# Altium schematic sheet BLDC_Controller_Sch.SchDoc
size A2
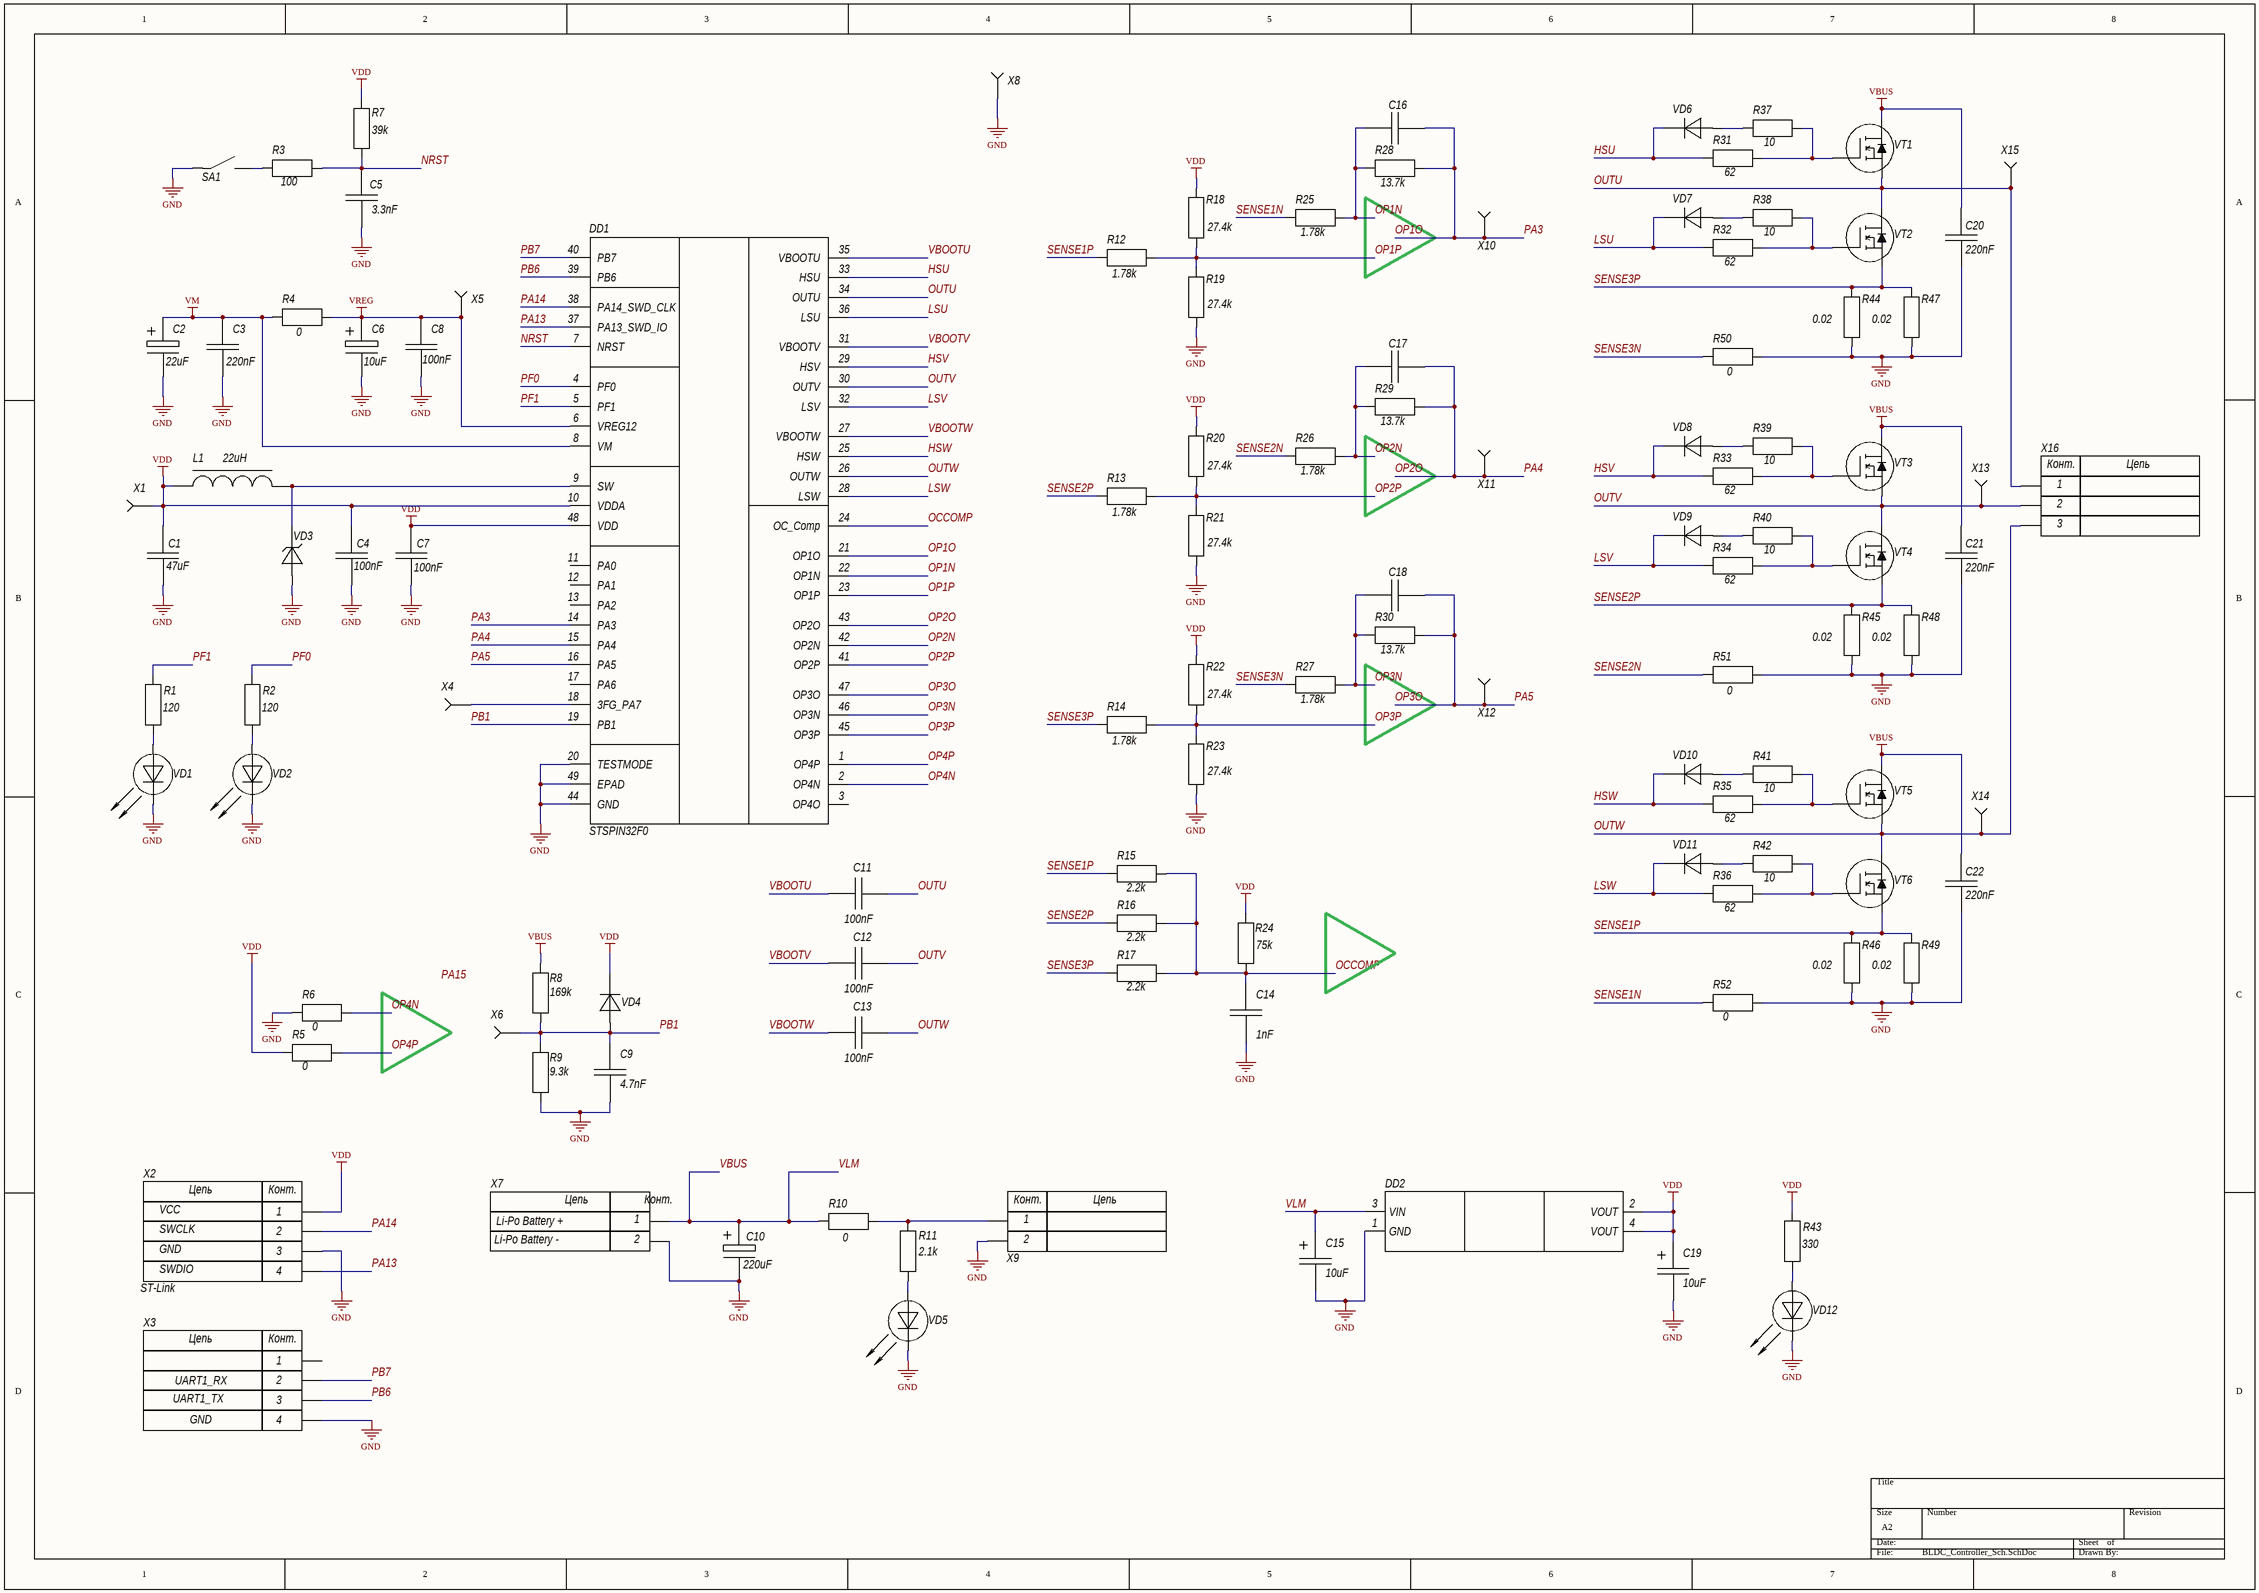
[diagram p0: BLDC_Controller_Sch.SchDoc]

## Parts
C1  value 47uF  [CAP EIA 0603]  (hidden comment: Cap EIA 0603)
C2  value 22uF  [CAP EL CASE F]  (hidden comment: Cap El SMT Case F)
C3  value 220nF  [CAP EIA 0805]  (hidden comment: Cap EIA 0805)
C4  value 100nF  [CAP EIA 0603]  (hidden comment: Cap EIA 0603)
C5  value 3.3nF  [CAP EIA 0805]  (hidden comment: Cap EIA 0805)
C6  value 10uF  [CAP EL CASE F]  (hidden comment: Cap El SMT Case F)
C7  value 100nF  [CAP EIA 0603]  (hidden comment: Cap EIA 0603)
C8  value 100nF  [CAP EIA 0805]  (hidden comment: Cap EIA 0805)
C9  value 4.7nF  [CAP EIA 0603]  (hidden comment: Cap EIA 0603)
C10  value 220uF  [CAP EL CASE F]  (hidden comment: Cap El SMT Case F)
C11  value 100nF  [CAP EIA 0603]  (hidden comment: Cap EIA 0603)
C12  value 100nF  [CAP EIA 0603]  (hidden comment: Cap EIA 0603)
C13  value 100nF  [CAP EIA 0603]  (hidden comment: Cap EIA 0603)
C14  value 1nF  [CAP EIA 0603]  (hidden comment: Cap EIA 0603)
C15  value 10uF  [CAP CASE A]  (hidden comment: Cap El Case A (Tantalum))
C16  Cap EIA 0603  [CAP EIA 0603]  (value not drawn)
C17  Cap EIA 0603  [CAP EIA 0603]  (value not drawn)
C18  Cap EIA 0603  [CAP EIA 0603]  (value not drawn)
C19  value 10uF  [CAP CASE A]  (hidden comment: Cap El Case A (Tantalum))
C20  value 220nF  [CAP EIA 0805]  (hidden comment: Cap EIA 0805)
C21  value 220nF  [CAP EIA 0805]  (hidden comment: Cap EIA 0805)
C22  value 220nF  [CAP EIA 0805]  (hidden comment: Cap EIA 0805)
DD1  STSPIN32F0  [VFQFPN48 7 x 7 x 1.0 - 48L]
DD2  LM1117S50  [SOT-223_M]  (value not drawn)
L1  22uH  [SRN3015]
R1  value 120  [RES EIA 0603]  (hidden comment: Res EIA 0603)
R2  value 120  [RES EIA 0603]  (hidden comment: Res EIA 0603)
R3  value 100  [RES EIA 0603]  (hidden comment: Res EIA 0603)
R4  value 0  [RES EIA 0603]  (hidden comment: Res EIA 0603)
R5  value 0  [RES EIA 0603]  (hidden comment: Res EIA 0603)
R6  value 0  [RES EIA 0603]  (hidden comment: Res EIA 0603)
R7  value 39k  [RES EIA 0603]  (hidden comment: Res EIA 0603)
R8  value 169k  [RES EIA 0603]  (hidden comment: Res EIA 0603)
R9  value 9.3k  [RES EIA 0603]  (hidden comment: Res EIA 0603)
R10  value 0  [RES EIA 0603]  (hidden comment: Res EIA 0603)
R11  value 2.1k  [RES EIA 0805]  (hidden comment: Res EIA 0805)
R12  value 1.78k  [RES EIA 0603]  (hidden comment: Res EIA 0603)
R13  value 1.78k  [RES EIA 0603]  (hidden comment: Res EIA 0603)
R14  value 1.78k  [RES EIA 0603]  (hidden comment: Res EIA 0603)
R15  value 2.2k  [RES EIA 0603]  (hidden comment: Res EIA 0603)
R16  value 2.2k  [RES EIA 0603]  (hidden comment: Res EIA 0603)
R17  value 2.2k  [RES EIA 0603]  (hidden comment: Res EIA 0603)
R18  value 27.4k  [RES EIA 0603]  (hidden comment: Res EIA 0603)
R19  value 27.4k  [RES EIA 0603]  (hidden comment: Res EIA 0603)
R20  value 27.4k  [RES EIA 0603]  (hidden comment: Res EIA 0603)
R21  value 27.4k  [RES EIA 0603]  (hidden comment: Res EIA 0603)
R22  value 27.4k  [RES EIA 0603]  (hidden comment: Res EIA 0603)
R23  value 27.4k  [RES EIA 0603]  (hidden comment: Res EIA 0603)
R24  value 75k  [RES EIA 0603]  (hidden comment: Res EIA 0603)
R25  value 1.78k  [RES EIA 0603]  (hidden comment: Res EIA 0603)
R26  value 1.78k  [RES EIA 0603]  (hidden comment: Res EIA 0603)
R27  value 1.78k  [RES EIA 0603]  (hidden comment: Res EIA 0603)
R28  value 13.7k  [RES EIA 0603]  (hidden comment: Res EIA 0603)
R29  value 13.7k  [RES EIA 0603]  (hidden comment: Res EIA 0603)
R30  value 13.7k  [RES EIA 0603]  (hidden comment: Res EIA 0603)
R31  value 62  [RES EIA 0603]  (hidden comment: Res EIA 0603)
R32  value 62  [RES EIA 0603]  (hidden comment: Res EIA 0603)
R33  value 62  [RES EIA 0603]  (hidden comment: Res EIA 0603)
R34  value 62  [RES EIA 0603]  (hidden comment: Res EIA 0603)
R35  value 62  [RES EIA 0603]  (hidden comment: Res EIA 0603)
R36  value 62  [RES EIA 0603]  (hidden comment: Res EIA 0603)
R37  value 10  [RES EIA 0603]  (hidden comment: Res EIA 0603)
R38  value 10  [RES EIA 0603]  (hidden comment: Res EIA 0603)
R39  value 10  [RES EIA 0603]  (hidden comment: Res EIA 0603)
R40  value 10  [RES EIA 0603]  (hidden comment: Res EIA 0603)
R41  value 10  [RES EIA 0603]  (hidden comment: Res EIA 0603)
R42  value 10  [RES EIA 0603]  (hidden comment: Res EIA 0603)
R43  value 330  [RES EIA 0603]  (hidden comment: Res EIA 0603)
R44  value 0.02  [RES EIA 2512]  (hidden comment: Res EIA 2512)
R45  value 0.02  [RES EIA 2512]  (hidden comment: Res EIA 2512)
R46  value 0.02  [RES EIA 2512]  (hidden comment: Res EIA 2512)
R47  value 0.02  [RES EIA 2512]  (hidden comment: Res EIA 2512)
R48  value 0.02  [RES EIA 2512]  (hidden comment: Res EIA 2512)
R49  value 0.02  [RES EIA 2512]  (hidden comment: Res EIA 2512)
R50  value 0  [RES EIA 0603]  (hidden comment: Res EIA 0603)
R51  value 0  [RES EIA 0603]  (hidden comment: Res EIA 0603)
R52  value 0  [RES EIA 0603]  (hidden comment: Res EIA 0603)
SA1  IT-1187  [IT-1187]  (value not drawn)
VD1  KP-2012xxxx  [SMD LED 0805 (GREEN)]  (value not drawn)
VD2  KP-2012xxxx  [SMD LED 0805 (GREEN)]  (value not drawn)
VD3  SMCJ5.0A  [DO-214AB]  (value not drawn)
VD4  BAT54HT1G  [SOD-323]  (value not drawn)
VD5  KP-2012xxxx  [SMD LED 0805 (GREEN)]  (value not drawn)
VD6  4148WS  [SOD-323]  (value not drawn)
VD7  4148WS  [SOD-323]  (value not drawn)
VD8  4148WS  [SOD-323]  (value not drawn)
VD9  4148WS  [SOD-323]  (value not drawn)
VD10  4148WS  [SOD-323]  (value not drawn)
VD11  4148WS  [SOD-323]  (value not drawn)
VD12  KP-2012xxxx  [SMD LED 0805 (GREEN)]  (value not drawn)
VT1  IRLZ44NS  [D2PAK_M]  (value not drawn)
VT2  IRLZ44NS  [D2PAK_M]  (value not drawn)
VT3  IRLZ44NS  [D2PAK_M]  (value not drawn)
VT4  IRLZ44NS  [D2PAK_M]  (value not drawn)
VT5  IRLZ44NS  [D2PAK_M]  (value not drawn)
VT6  IRLZ44NS  [D2PAK_M]  (value not drawn)
X1  Pin  [Pin]  (value not drawn)  (no BOM)
X2  ST-Link  [SWD]
X3  PLS-4  [SWD]  (value not drawn)
X4  Pin  [Pin]  (value not drawn)  (no BOM)
X5  Pin  [Pin]  (value not drawn)  (no BOM)
X6  Pin  [Pin]  (value not drawn)  (no BOM)
X7  TB2  [TB2]  (value not drawn)
X8  Pin  [Pin]  (value not drawn)  (no BOM)
X9  TB2  [TB2]  (value not drawn)
X10  Pin  [Pin]  (value not drawn)  (no BOM)
X11  Pin  [Pin]  (value not drawn)  (no BOM)
X12  Pin  [Pin]  (value not drawn)  (no BOM)
X13  Pin  [Pin]  (value not drawn)  (no BOM)
X14  Pin  [Pin]  (value not drawn)  (no BOM)
X15  Pin  [Pin]  (value not drawn)  (no BOM)
X16  TB3  [TB3]  (value not drawn)

## Nets
GND: C1.1 C2.2 C3.1 C4.1 C5.1 C6.2 C7.1 C8.2 C9.1 C10.2 C14.1 C15.2 C19.2 C20.1 C21.1 C22.1 DD1.20(TESTMODE) DD1.44(GND) DD1.49(EPAD) DD2.1(GND) R6.1 R9.1 R19.1 R21.1 R23.1 R44.1 R45.1 R46.1 R47.2 R48.2 R49.2 R50.2 R51.2 R52.2 SA1.1 VD1.2(K) VD2.2(K) VD3.2(A) VD5.2(K) VD12.2(K) X2.3(GND) X3.4 X7.2 X8.1 X9.2
VBUS: C10.1 C15.1 C20.2 C21.2 C22.2 DD2.3(VIN) R8.2 R10.1 VT1.2(D) VT3.2(D) VT5.2(D) X7.1  [also labelled VLM]
VDD: C1.2 C4.2 C7.2 C19.1 DD1.10(VDDA) DD1.48(VDD) DD2.2(VOUT) DD2.4(VOUT) L1.1 R5.1 R7.2 R18.2 R20.2 R22.2 R24.2 R43.1 VD4.2(K) X1.1 X2.1(VCC)
VM: C2.1 C3.2 DD1.8(VM) R4.1
VREG: C6.1 C8.1 DD1.6(VREG12) R4.2 X5.1
HSU: DD1.33(HSU) R31.1 VD6.1(K)
HSV: DD1.29(HSV) R33.1 VD8.1(K)
HSW: DD1.25(HSW) R35.1 VD10.1(K)
LSU: DD1.36(LSU) R32.1 VD7.1(K)
LSV: DD1.32(LSV) R34.1 VD9.1(K)
LSW: DD1.28(LSW) R36.1 VD11.1(K)
NRST: C5.2 DD1.7(NRST) R3.2 R7.1
OCCOMP: C14.2 DD1.24(OC_Comp) R15.2 R16.2 R17.2 R24.1
OP1N: C16.1 DD1.22(OP1N) R25.2 R28.1
OP1O: C16.2 DD1.14(PA3) DD1.21(OP1O) R28.2 X10.1  [also labelled PA3]
OP1P: DD1.23(OP1P) R12.2 R18.1 R19.2
OP2N: C17.1 DD1.42(OP2N) R26.2 R29.1
OP2O: C17.2 DD1.15(PA4) DD1.43(OP2O) R29.2 X11.1  [also labelled PA4]
OP2P: DD1.41(OP2P) R13.2 R20.1 R21.2
OP3N: C18.1 DD1.46(OP3N) R27.2 R30.1
OP3O: C18.2 DD1.16(PA5) DD1.47(OP3O) R30.2 X12.1  [also labelled PA5]
OP3P: DD1.45(OP3P) R14.2 R22.1 R23.2
OP4N: DD1.2(OP4N) R6.2
OP4P: DD1.1(OP4P) R5.2
OUTU: C11.2 DD1.34(OUTU) VT1.3(S) VT2.2(D) X15.1 X16.1
OUTV: C12.2 DD1.30(OUTV) VT3.3(S) VT4.2(D) X13.1 X16.2
OUTW: C13.2 DD1.26(OUTW) VT5.3(S) VT6.2(D) X14.1 X16.3
PA13: DD1.37(PA13_SWD_IO) X2.4(SWDIO)
PA14: DD1.38(PA14_SWD_CLK) X2.2(SWCLK)
PB1: C9.2 DD1.19(PB1) R8.1 R9.2 VD4.1(A) X6.1
PB6: DD1.39(PB6) X3.3
PB7: DD1.40(PB7) X3.2
PF0: DD1.4(PF0) R2.1
PF1: DD1.5(PF1) R1.1
SENSE1N: R25.1 R52.1
SENSE1P: R12.1 R15.1 R46.2 R49.1 VT6.3(S)
SENSE2N: R26.1 R51.1
SENSE2P: R13.1 R16.1 R45.2 R48.1 VT4.3(S)
SENSE3N: R27.1 R50.1
SENSE3P: R14.1 R17.1 R44.2 R47.1 VT2.3(S)
VBOOTU: C11.1 DD1.35(VBOOTU)
VBOOTV: C12.1 DD1.31(VBOOTV)
VBOOTW: C13.1 DD1.27(VBOOTW)
NetDD1_9: DD1.9(SW) L1.2 VD3.1(K)
NetDD1_18: DD1.18(3FG_PA7) X4.1
NetR1_2: R1.2 VD1.1(A)
NetR2_2: R2.2 VD2.1(A)
NetR3_1: R3.1 SA1.2
NetR10_2: R10.2 R11.2 X9.1
NetR11_1: R11.1 VD5.1(A)
NetR31_2: R31.2 R37.2 VT1.1(G)
NetR32_2: R32.2 R38.2 VT2.1(G)
NetR33_2: R33.2 R39.2 VT3.1(G)
NetR34_2: R34.2 R40.2 VT4.1(G)
NetR35_2: R35.2 R41.2 VT5.1(G)
NetR36_2: R36.2 R42.2 VT6.1(G)
NetR37_1: R37.1 VD6.2(A)
NetR38_1: R38.1 VD7.2(A)
NetR39_1: R39.1 VD8.2(A)
NetR40_1: R40.1 VD9.2(A)
NetR41_1: R41.1 VD10.2(A)
NetR42_1: R42.1 VD11.2(A)
NetR43_2: R43.2 VD12.1(A)

Not connected (* = marked no-connect by the designer): DD1 3(OP4O) 11(PA0) 12(PA1) 13(PA2) 17(PA6); X3 1

## Notes on the sheet
- Li-Po Battery -
- Li-Po Battery +
- UART1_TX
- UART1_RX
- GND
- Labels drawn without touching a wire or pin: PA15
- (in symbol PLS-4) Цепь; Конт.
- (in symbol SWD(PLS- 4)) Цепь; Конт.
- (in symbol TB2) Цепь; Конт.
- (in symbol TB3) Конт.; Цепь

## Library data of the parts
C1 C4 C7 C9 C11-C14 C16-C18 = Cap EIA 0603: Group: Конденсаторы; Manufacturer: *; Name: *; Supplier: *
  C16-C18: Value: *
C2 C6 C10 = Cap El SMT Case F: 8.0x10.5 mm Surface Mount Aluminum Electrolytic Capacitor; Group: Конденсаторы; Manufacturer: *; Name: *; Supplier: *
C3 C5 C8 C20-C22 = Cap EIA 0805: Group: Конденсаторы; Manufacturer: *; Name: *; Supplier: *
C15 C19 = Cap El Case A (Tantalum): Group: Конденсаторы; Manufacturer: *; Name: *; Supplier: *
DD1 = STSPIN32F0: Микросхема управления бесколлекторным эл.двигателем; Manufacture: ST; Group: Микросхемы; Value: Микросхема управления бесколлекторным эл.двиг.; Name: STSPIN32F0; Supplier: Магазин: hkhonbo Store; Information: https://www.st.com/resource/en/datasheet/stspin32f0.pdf
DD2 = LM1117S50: LDO Voltage Regulator; Manufacturer: ST Microelectronics; Group: Микросхемы; Value: Регулятор напряжения LDO 800mA; Name: LM1117S50; Supplier: ООО "Торгэлектроника"
L1 = SRN3015: Semi-shielded Power Inductors; Manufacturer: Bourns; Group: Индуктивности; Value: Дроссель - Ток:  А; Ток насыщения:  А; Индуктивность:  мкГн; Допуск: ±%;; Name: SRN3015-xxxx; Supplier: Компэл
R1-R10 R12-R43 R50-R52 = Res EIA 0603: Group: Резисторы; Manufacturer: *; Name: *; Supplier: *
R11 = Res EIA 0805: Group: Резисторы; Manufacturer: *; Name: *; Supplier: *
R44-R49 = Res EIA 2512: Group: Резисторы; Manufacturer: *; Name: *; Supplier: *
SA1 = IT-1187: Тактовая кнопка; Manufacturer: Switronic Industrial Corp.; Group: Переключатели; Value: Тактовые кнопки  4х4 мм. SMD h=1,5 мм.; Name: IT-1187; Supplier: ООО"Торгэлектроника"
VD1 VD2 VD5 VD12 = FYLS-0805xxxx: SMD Led; Manufacture: Foryard (FORYARD); Group: Диоды; Value: Светодиод общего назначения - Цвет: Красный; N: 1; λ1:  645 нм; Iv1: 80 мкд; U: 2.6 В;; Name: KP-2012xxxx; Supplier: ООО "Компэл"
VD3 = SMCJ5.0A: TVS Диод, двунаправленный, Uраб. = 5В, Uпроб. = 6,74В, P = 1500 Вт; Manufacture: ST Microelectronics (ST); Group: Диоды; Value: TVS Диод, однонаправленный, Uраб. = 5В, Uпроб. = 6,74В, P = 1500 Вт; Name: SMCJ5.0A; Supplier: ООО "Компэл"
VD4 = BAT54HT1G: SCHOTTKY BARRIER DIOD 0.2 AMPERES, 30 VOLTS; Manufacture: ON Semiconductor; Group: Диоды; Name: BAT54HT1G; Supplier: ООО "Компэл"; Value: SCHOTTKY BARRIER DIOD 0.2 AMPERES, 30 VOLTS
VD6-VD11 = 4148WS: Diod, 150mA, 100V(SOD-323); Manufacture: Diodes Incorporated; Group: Диоды; Name: 1N4148WS; Value: 150mA, 100V, SOD-323; Supplier: Магазин: CHANZON Official Store
VT1-VT6 = IRLZ44NS: HEXFET Power MOSFET; Manufacturer: International Rectifier; Name: IRLZ44NSPBF; Group: Транзисторы; Value: MOSFET силовой транзистор - Тип: N; Uси: 50 В; Rси(вкл): 0.35...0.25 Ом; Iси: 40А;; Supplier: ООО "Торгэлектроника"
X1 X4-X6 X8 X10-X15 = Pin: Generic Pin Contact; Group: -; Manufacturer: -; Name: -; Value: Generic Pin Contact; Supplier: -
X2 = SWD(PLS- 4): Manufacturer: Тайвань(Китай); Name: PLS- 4; Group: Разъемы; Value: Вилка штыревая 2.54мм 1x4 прям; Supplier: ООО"Торгэлектроника"
X3 = PLS-4: Manufacturer: Hsuan Mao(Китай); Group: Разъемы; Value: Разъем штыревой четырехконтактный; Name: PLS-4; Supplier: ООО"Торгэлектроника"
X7 X9 = TB2: Group: Разъемы; Manufacturer: *; Name: *; Value: *; Supplier: *
X16 = TB3: Group: Разъемы; Manufacturer: *; Name: *; Value: *; Supplier: *